# Altium schematic sheet Voltage_Ref.SchDoc
size A; SheetNumber: 4; SheetTotal: 6
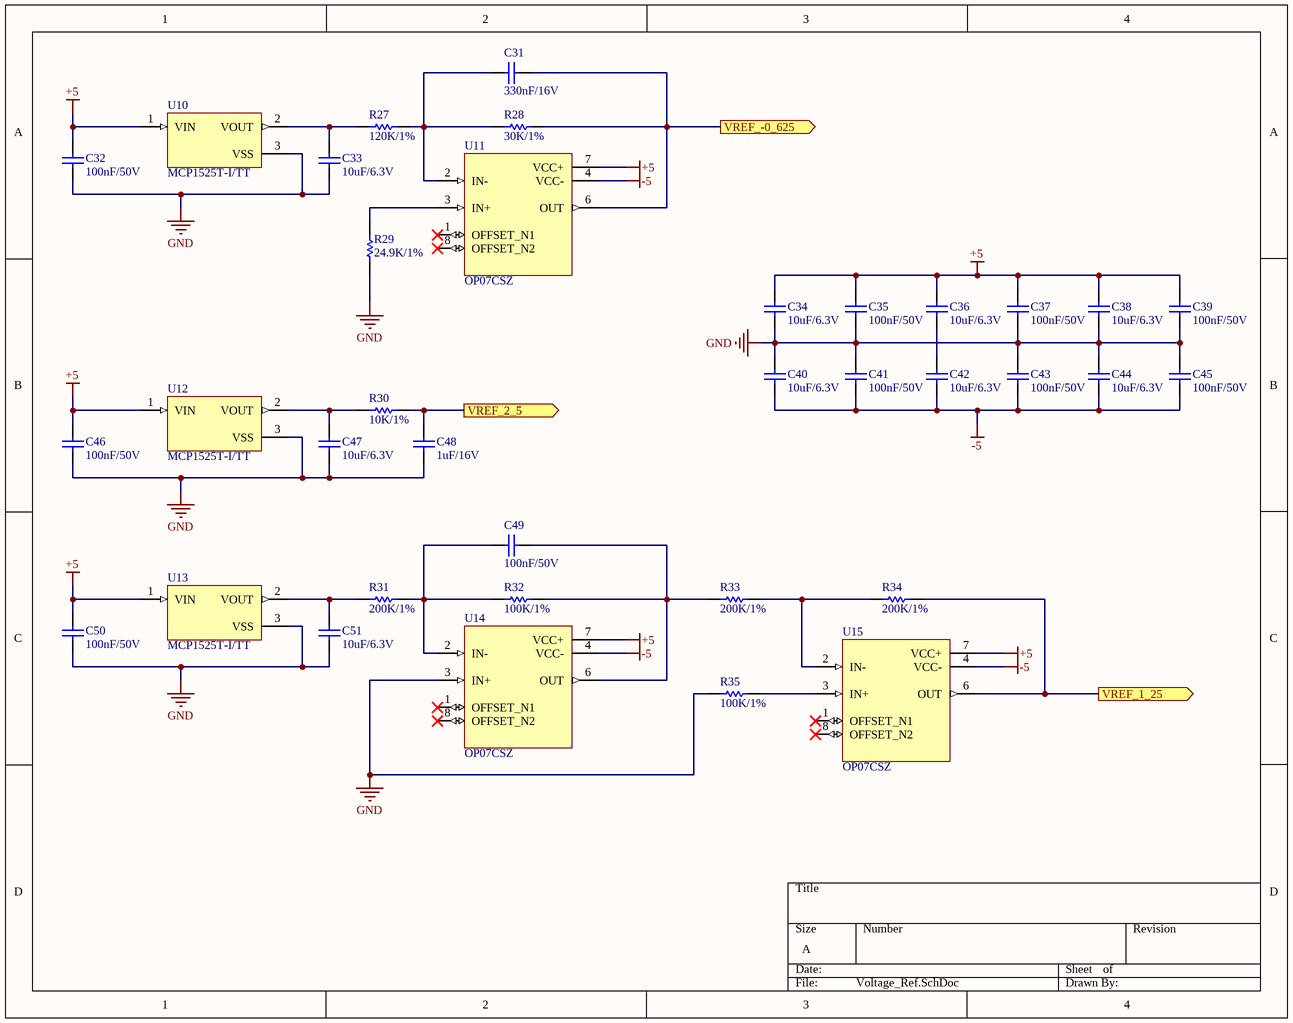
[diagram p0: Voltage_Ref.SchDoc]

## Parts
C31  330nF/16V  [CAP_0805]
C32  100nF/50V  [CAP_0805]
C33  10uF/6.3V  [CAP_0805]
C34  10uF/6.3V  [CAP_0805]
C35  100nF/50V  [CAP_0805]
C36  10uF/6.3V  [CAP_0805]
C37  100nF/50V  [CAP_0805]
C38  10uF/6.3V  [CAP_0805]
C39  100nF/50V  [CAP_0805]
C40  10uF/6.3V  [CAP_0805]
C41  100nF/50V  [CAP_0805]
C42  10uF/6.3V  [CAP_0805]
C43  100nF/50V  [CAP_0805]
C44  10uF/6.3V  [CAP_0805]
C45  100nF/50V  [CAP_0805]
C46  100nF/50V  [CAP_0805]
C47  10uF/6.3V  [CAP_0805]
C48  1uF/16V  [CAP_0805]
C49  100nF/50V  [CAP_0805]
C50  100nF/50V  [CAP_0805]
C51  10uF/6.3V  [CAP_0805]
R27  120K/1%  [RES_0805]
R28  30K/1%  [RES_0805]
R29  24.9K/1%  [RES_0805]
R30  10K/1%  [RES_0805]
R31  200K/1%  [RES_0805]
R32  100K/1%  [RES_0805]
R33  200K/1%  [RES_0805]
R34  200K/1%  [RES_0805]
R35  100K/1%  [RES_0805]
U10  MCP1525T-I/TT  [SOT95P237X112-3N]
U11  OP07CSZ  [SOIC127P600X175-8N]
U12  MCP1525T-I/TT  [SOT95P237X112-3N]
U13  MCP1525T-I/TT  [SOT95P237X112-3N]
U14  OP07CSZ  [SOIC127P600X175-8N]
U15  OP07CSZ  [SOIC127P600X175-8N]

## Ports
VREF_1_25 (out), VREF_2_5 (out), VREF_-0_625 (out)

## Nets
+5: C32.2 C34.2 C35.2 C36.2 C37.2 C38.2 C39.2 C46.2 C50.2 U10.1(VIN) U11.7(VCC+) U12.1(VIN) U13.1(VIN) U14.7(VCC+) U15.7(VCC+)
-5: C40.1 C41.1 C42.1 C43.1 C44.1 C45.1 U11.4(VCC-) U14.4(VCC-) U15.4(VCC-)
GND: C32.1 C33.1 C34.1 C35.1 C37.1 C38.1 C39.1 C40.2 C41.2 C43.2 C44.2 C45.2 C46.1 C47.1 C48.1 C50.1 C51.1 R29.1 R35.1 U10.3(VSS) U12.3(VSS) U13.3(VSS) U14.3(IN+)
VREF_1_25: R34.2 U15.6(OUT) ; port VREF_1_25
VREF_2_5: C48.2 R30.1 ; port VREF_2_5
VREF_-0_625: C31.1 R28.2 U11.6(OUT) ; port VREF_-0_625
NetC31_2: C31.2 R27.2 R28.1 U11.2(IN-)
NetC33_2: C33.2 R27.1 U10.2(VOUT)
NetC36_1: C36.1 C42.2
NetC47_2: C47.2 R30.2 U12.2(VOUT)
NetC49_1: C49.1 R32.2 R33.1 U14.6(OUT)
NetC49_2: C49.2 R31.2 R32.1 U14.2(IN-)
NetC51_2: C51.2 R31.1 U13.2(VOUT)
NetR29_2: R29.2 U11.3(IN+)
NetR33_2: R33.2 R34.1 U15.2(IN-)
NetR35_2: R35.2 U15.3(IN+)

Not connected (* = marked no-connect by the designer): U11 1(OFFSET_N1)* 8(OFFSET_N2)*; U14 1(OFFSET_N1)* 8(OFFSET_N2)*; U15 1(OFFSET_N1)* 8(OFFSET_N2)*

## Library data of the parts
C31-C51 = Capacitor: Size: 0805
  C31: URL: https://www.thegioiic.com/tu-gom-0805-330nf-16v; Value: 330nF/16V
  C32 C35 C37 C39 C41 C43 C45 C46 C49 C50: URL: https://www.thegioiic.com/tu-gom-0805-100nf-0-1uf-50v; Value: 100nF/50V
  C33 C34 C36 C38 C40 C42 C44 C47 C51: URL: https://www.thegioiic.com/tu-gom-0805-10uf-6-3v; Value: 10uF/6.3V
  C48: URL: https://www.thegioiic.com/tu-gom-0805-1uf-16v; Value: 1uF/16V
R27-R35 = Resistor: Size: 0805
  R27: URL: https://www.thegioiic.com/dien-tro-120-kohm-0805-1-; Value: 120K/1%
  R28: URL: https://www.thegioiic.com/dien-tro-30-kohm-0805-1-; Value: 30K/1%
  R29: URL: https://www.thegioiic.com/dien-tro-24-9-kohm-0805-1-; Value: 24.9K/1%
  R30: URL: https://www.thegioiic.com/dien-tro-10-kohm-0805-1-; Value: 10K/1%
  R31 R33 R34: URL: https://www.thegioiic.com/dien-tro-200-kohm-0805-1-; Value: 200K/1%
  R32 R35: URL: https://www.thegioiic.com/dien-tro-100-kohm-0805-1-; Value: 100K/1%
U10 U12 U13 = MCP1525T-I/TT: Series Voltage Reference IC Â±1% SOT-23-3; Value: 2.5VDC; Size: SOT-23; URL: https://www.thegioiic.com/mcp1525t-i-tt-ic-tham-chieu-dien-ap-2-5v-sot-23
U11 U14 U15 = OP07CSZ: Low-Offset Voltage Operational Amplifier; Size: 8-SOIC; URL: https://www.thegioiic.com/op07csz-ic-opamp-general-purpose-amplifier-1-circuit-600khz-8-soic; Value: OP07CSZ